# EAGLE design CANFLYSKY (EAGLE 9.0.1)
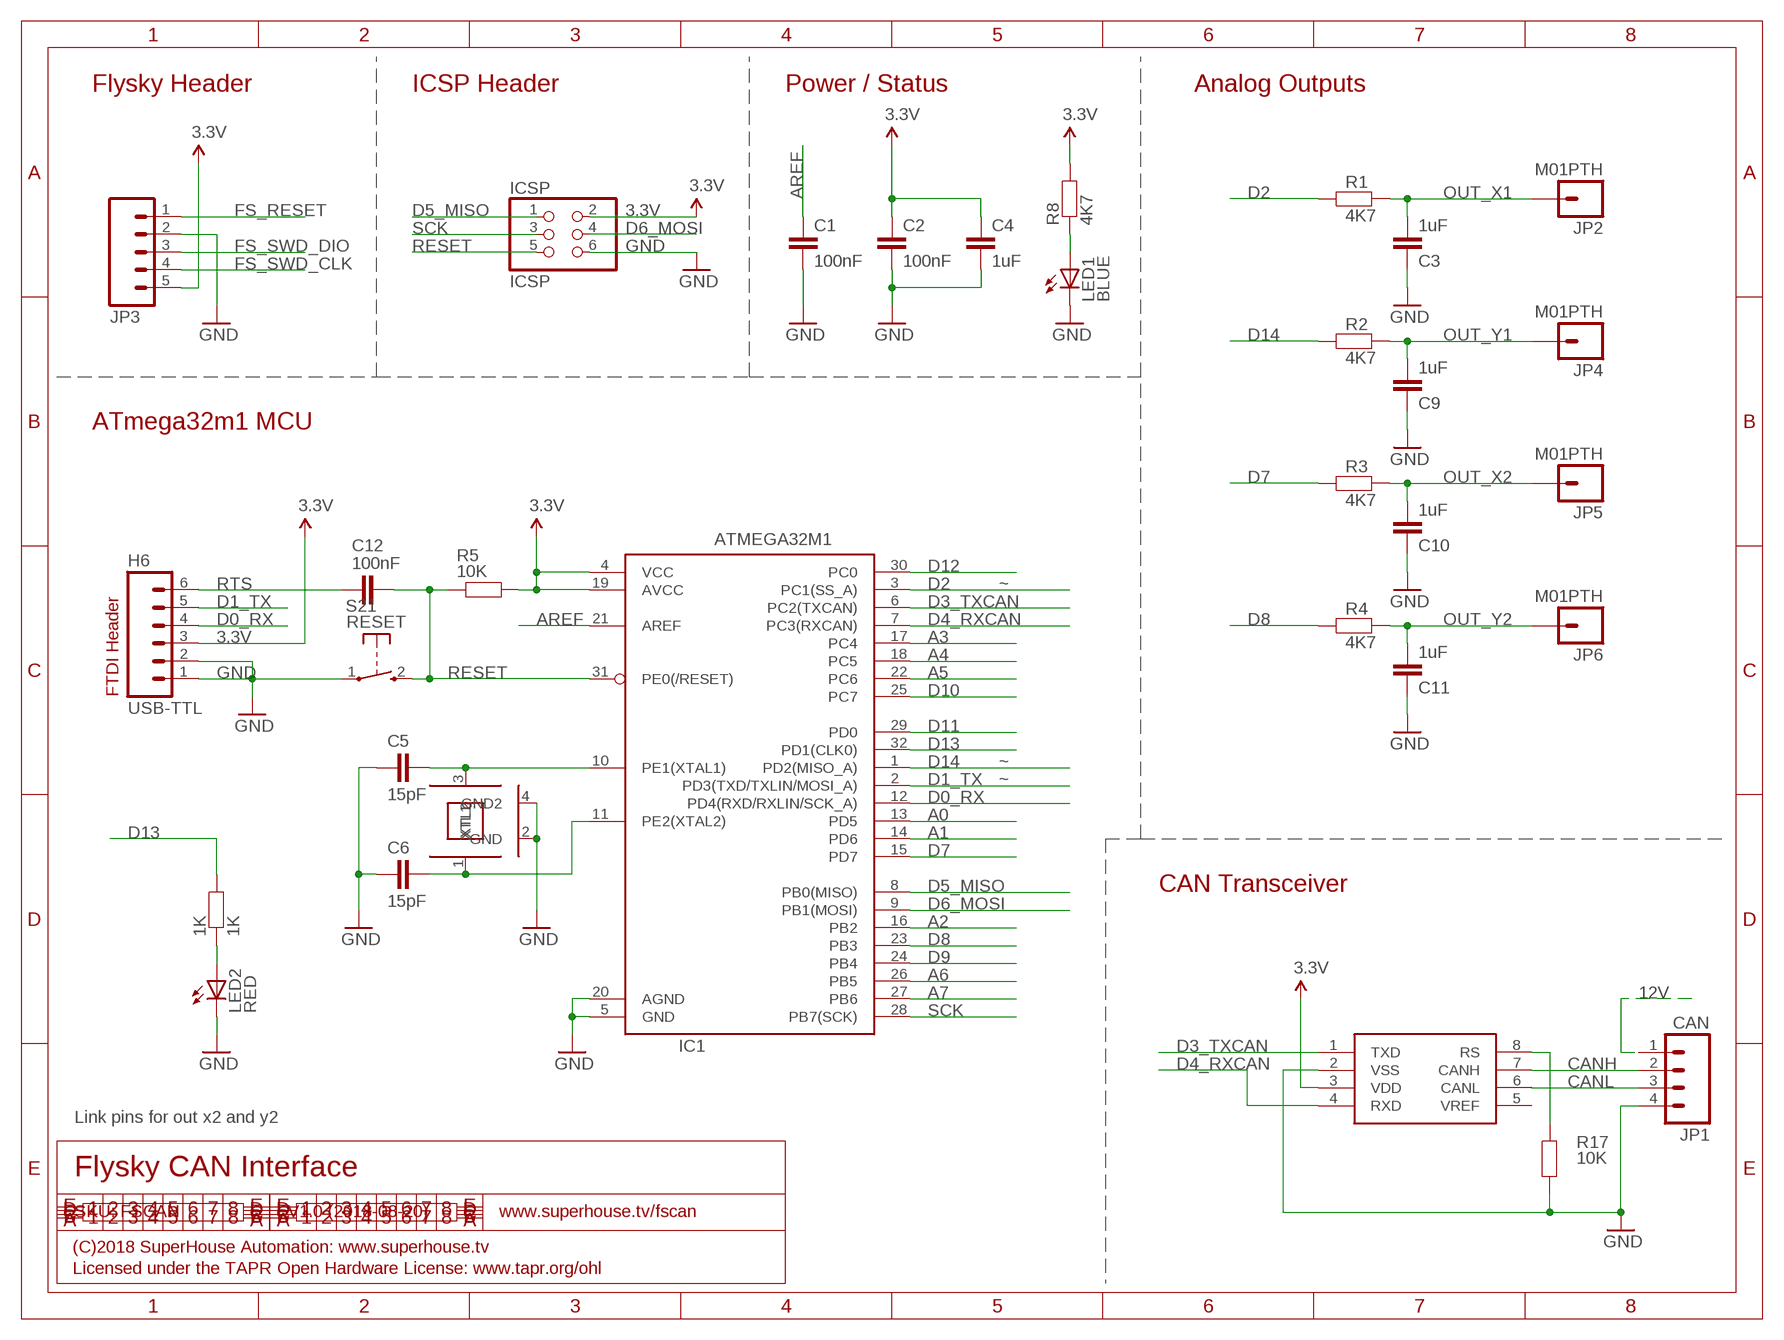
[diagram p0: schematic, sheet 1]

## Parts
1K  1K  RESISTOR0603  [0603]
C1  100nF  CAP0603  [0603]
C2  100nF  CAP0603  [0603]
C3  1uF  CAP0603  [0603]
C4  1uF  CAP0603  [0603]
C5  15pF  CAP0603  [0603]
C6  15pF  CAP0603  [0603]
C9  1uF  CAP0603  [0603]
C10  1uF  CAP0603  [0603]
C11  1uF  CAP0603  [0603]
C12  100nF  CAP0603  [0603]
H6  USB-TTL  M06SIP  [1X06]
IC1  ATMEGA32M1  [TQFP32-08]
ICSP  ICSP  PINHD-2X3  [2X03]
JP1  CAN  M04PTH  [1X04]
JP2  M01PTH  [1X01]
JP3  M05PTH  [1X05]
JP4  M01PTH  [1X01]
JP5  M01PTH  [1X01]
JP6  M01PTH  [1X01]
LED1  BLUE  LED0603  [LED-0603]
LED2  RED  LED0603  [LED-0603]
R1  4K7  RESISTOR0603  [0603]
R2  4K7  RESISTOR0603  [0603]
R3  4K7  RESISTOR0603  [0603]
R4  4K7  RESISTOR0603  [0603]
R5  10K  RESISTOR0603  [0603]
R8  4K7  RESISTOR0603  [0603]
R17  10K  RESISTOR0603  [0603]
S21  RESET  TAC_SWITCH_2PINSMT  [TACTILE_SWITCH_SMD_2PIN_TINY]
U1  MCP2551  [SO08]
XTL1  8MHz  CRYSTAL-GND3X2  [CRYSTAL-SMD-3X2]

## Nets
3.3V: C2.1 C4.1 H6.3 IC1.4(VCC) IC1.19(AVCC) ICSP.2 JP3.5 R5.1 R8.2 U1.3(VDD)
12V: JP1.1
A0: IC1.13(PD5)
A1: IC1.14(PD6)
A2: IC1.16(PB2)
A3: IC1.17(PC4)
A4: IC1.18(PC5)
A5: IC1.22(PC6)
A6: IC1.26(PB5)
A7: IC1.27(PB6)
AREF: C1.1 IC1.21(AREF)
CANH: JP1.2 U1.7(CANH)
CANL: JP1.3 U1.6(CANL)
D0_RX: H6.4 IC1.12(PD4(RXD/RXLIN/SCK_A))
D1_TX: H6.5 IC1.2(PD3(TXD/TXLIN/MOSI_A))
D2: IC1.3(PC1(SS_A)) R1.1
D3_TXCAN: IC1.6(PC2(TXCAN)) U1.1(TXD)
D4_RXCAN: IC1.7(PC3(RXCAN)) U1.4(RXD)
D5_MISO: IC1.8(PB0(MISO)) ICSP.1
D6_MOSI: IC1.9(PB1(MOSI)) ICSP.4
D7: IC1.15(PD7) R3.1
D8: IC1.23(PB3) R4.1
D9: IC1.24(PB4)
D10: IC1.25(PC7)
D11: IC1.29(PD0)
D12: IC1.30(PC0)
D13: 1K.2 IC1.32(PD1(CLK0))
D14: IC1.1(PD2(MISO_A)) R2.1
FS_RESET: JP3.1
FS_SWD_CLK: JP3.4
FS_SWD_DIO: JP3.3
GND: C1.2 C2.2 C3.2 C4.2 C5.1 C6.1 C9.2 C10.2 C11.2 H6.1 H6.2 IC1.5(GND) IC1.20(AGND) ICSP.6 JP1.4 JP3.2 LED1.C LED2.C R17.1 S21.1(P) U1.2(VSS) XTL1.2(GND) XTL1.4(GND2)
N$1: 1K.1 LED2.A
N$5: LED1.A R8.1
N$11: C5.2 IC1.10(PE1(XTAL1)) XTL1.3(XTL2)
N$12: C6.2 IC1.11(PE2(XTAL2)) XTL1.1(XTL1)
N$16: R17.2 U1.8(RS)
OUT_X1: C3.1 JP2.1 R1.2
OUT_X2: C10.1 JP5.1 R3.2
OUT_Y1: C9.1 JP4.1 R2.2
OUT_Y2: C11.1 JP6.1 R4.2
RESET: C12.2 IC1.31(PE0(/RESET)) ICSP.5 R5.2 S21.2(S)
RTS: C12.1 H6.6
SCK: IC1.28(PB7(SCK)) ICSP.3
Unconnected: U1.5(VREF)

## Notes on the sheet
- Flysky Header | ICSP Header | Power / Status | Analog Outputs
- ATmega32m1 MCU
- ~
- FTDI Header
- ~
- ~
- CAN Transceiver
- Link pins for out x2 and y2
- Flysky CAN Interface
- SKU: FSCAN | V1.0 (2018-08-20) | www.superhouse.tv/fscan
- (C)2018 SuperHouse Automation: www.superhouse.tv
- Licensed under the TAPR Open Hardware License: www.tapr.org/ohl

## Library data of the parts
1K R8 = freetronics-jon:RESISTOR: Resistor Basic schematic elements and footprints for 0603, 1206, and PTH 1/10th watt (small) resistors.
C1-C6 C9-C12 = freetronics-master-v1.1:CAP: Capacitor Standard 0603 ceramic capacitor, and 0.1" leaded capacitor.
H6 = freetronics:M06: Header 6 Standard 6-pin 0.1" header. Use with straight break away headers (SKU : PRT-00116), right angle break away headers (PRT-00553), swiss pins (PRT-00743), machine pins (PRT-00117), and female headers (PRT-00115). Molex polarized connector foot print use with SKU : PRT-08094 with associated crimp pins and housings. NOTES ON THE VARIANTS LOCK and LOCK_LONGPADS... This footprint was designed to help hold the alignment of a through-hole component (i.e. 6-pin header) while soldering it into place. You may notice that each hole has been shifted either up or down by 0.005 of an inch from it's more standard position (which is a perfectly straight line). This slight alteration caused the pins (the squares in the middle) to touch the edges of the holes. Because they are alternating, it causes a "brace" to hold the component in place. 0.005 has proven to be the perfect amount of "off-center" position when using our standard breakaway headers. Although looks a little odd when you look at the bare footprint, once you have a header in there, the alteration is very hard to notice. Also, if you push a header all the way into place, it is covered up entirely on the bottom side. This idea of altering the position of holes to aid alignment will be further integrated into the Sparkfun Library for other footprints. It can help hold any component with 3 or more connection pins.
IC1 = freetronics-jon:ATMEGA32M1
ICSP = pinhead:PINHD-2X3: PIN HEADER
JP1 = freetronics-jon:M04: Header 4 Standard 4-pin 0.1" header. Use with straight break away headers (SKU : PRT-00116), right angle break away headers (PRT-00553), swiss pins (PRT-00743), machine pins (PRT-00117), and female headers (PRT-00115). Molex polarized connector foot print use with SKU : PRT-08231 with associated crimp pins and housings. 1MM SMD Version SKU: PRT-10208
JP2 JP4-JP6 = freetronics-jon:M01: Header 1 Standard 1-pin 0.1" header. Use with straight break away headers (SKU : PRT-00116), right angle break away headers (PRT-00553), swiss pins (PRT-00743), machine pins (PRT-00117), and female headers (PRT-00115).
JP3 = freetronics-jon:M05: Header 5 Standard 5-pin 0.1" header. Use with straight break away headers (SKU : PRT-00116), right angle break away headers (PRT-00553), swiss pins (PRT-00743), machine pins (PRT-00117), and female headers (PRT-00115). Molex polarized connector foot print use with SKU : PRT-08230 with associated crimp pins and housings.
LED1 LED2 = freetronics-jon:LED: LEDs Standard schematic elements and footprints for 5mm, 3mm, 1206, and 0603 sized LEDs. 5mm - Spark Fun Electronics SKU : COM-00529 (and others)
R1-R5 R17 = freetronics-master-v1.1:RESISTOR: Resistor Basic schematic elements and footprints for 0603, 1206, and PTH 1/10th watt (small) resistors.
S21 = freetronics-jon:TAC_SWITCH_2PIN: Momentary Tactile Switch - 2 pin
U1 = freetronics-original:MCP2551
XTL1 = freetronics-jon:CRYSTAL-GND

## Board
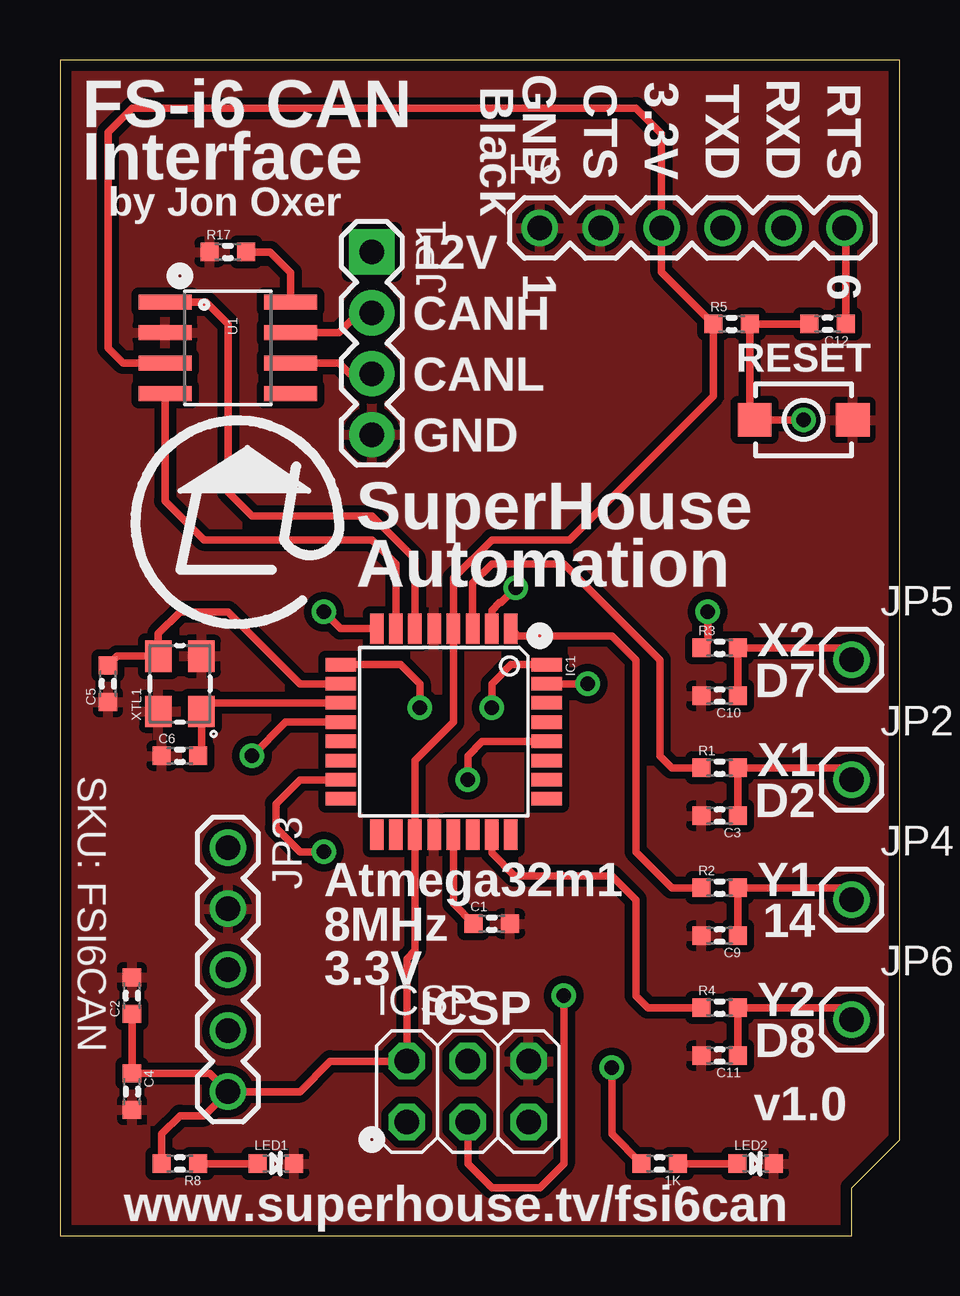
[diagram p1: board, top side]
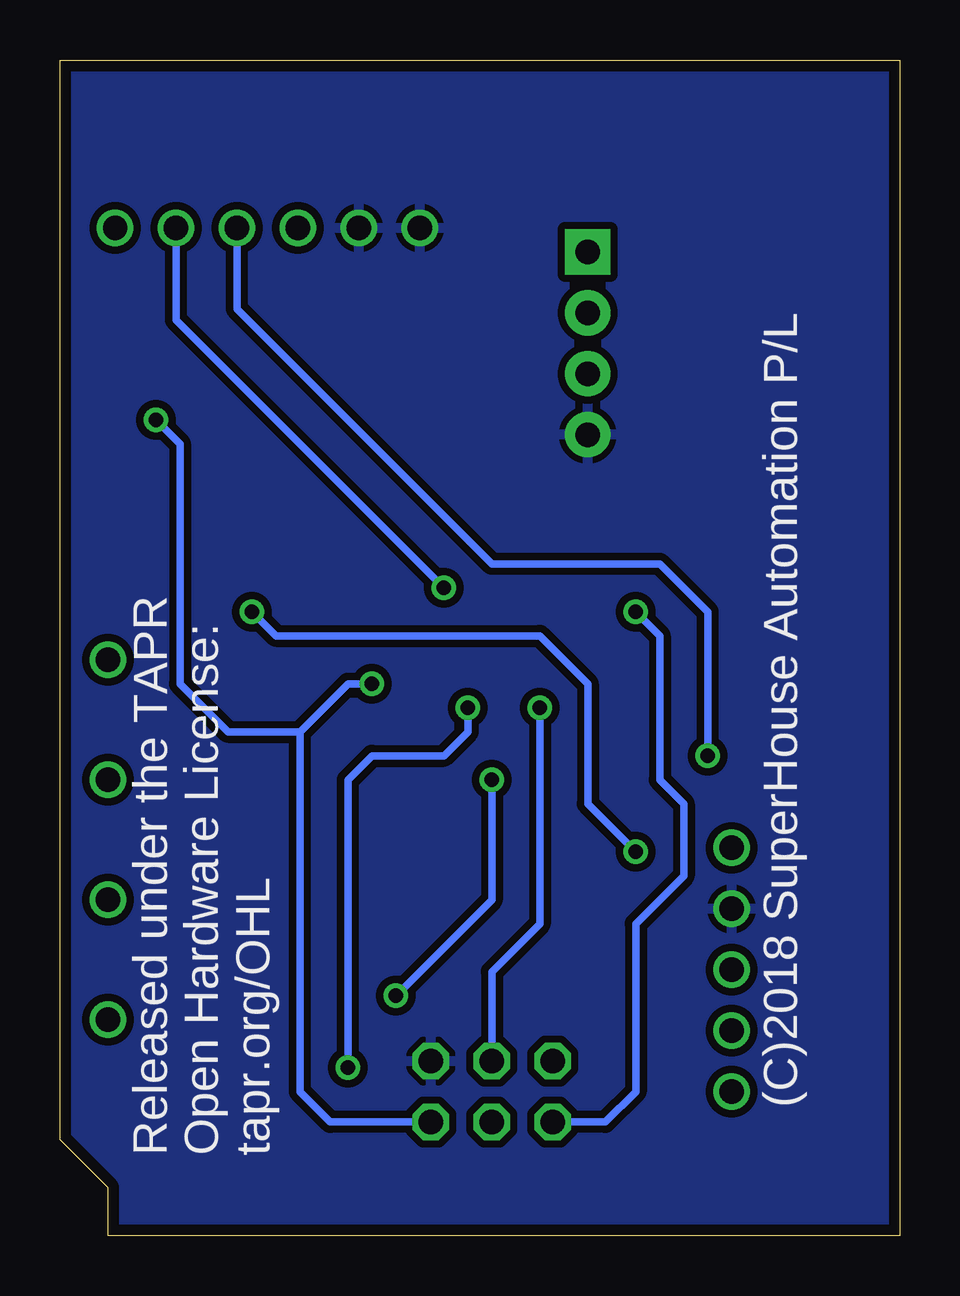
[diagram p2: board, bottom side, seen from below]

Size 35 x 49 mm. Coordinates in mm from the lower left corner, seen from the top.
Outline: 35,4 35,49 0,49 0,0 33,0 33,2 35,4
Copper layers (1*16): Top 0.035mm / dielectric 1.5mm / Bottom 0.035mm
Design rules "default *": minimum track width 10mil, minimum drill 24mil, track to track 12mil, track to pad 12mil, pad to pad 12mil, via to via 12mil, smd to smd 8mil, copper to edge 18mil, drill to drill 8mil, minimum pad ring 10mil, minimum via ring 8mil, stop-mask expansion 4mil, vias tented up to drill 0mil, thermal gap 10mil

### Footprints (pad centres in the part's own frame; a part is rotated, then mirrored left to right if it is on the bottom)
0603 = smd 0.762 x 0.762: 1 -0.762,0; 2 0.762,0
1X06 = drill 1.016: 1 0,0; 2 2.54,0; 3 5.08,0; 4 7.62,0; 5 10.16,0; 6 12.7,0
TQFP32-08 = smd 1.27 x 0.559: 1 -4.293,2.8; 2 -4.293,2; 3 -4.293,1.2; 4 -4.293,0.4; 5 -4.293,-0.4; 6 -4.293,-1.2; 7 -4.293,-2; 8 -4.293,-2.8; 17 4.293,-2.8; 18 4.293,-2; 19 4.293,-1.2; 20 4.293,-0.4; 21 4.293,0.4; 22 4.293,1.2; 23 4.293,2; 24 4.293,2.8 | smd 0.559 x 1.27: 9 -2.8,-4.293; 10 -2,-4.293; 11 -1.2,-4.293; 12 -0.4,-4.293; 13 0.4,-4.293; 14 1.2,-4.293; 15 2,-4.293; 16 2.8,-4.293; 25 2.8,4.293; 26 2,4.293; 27 1.2,4.293; 28 0.4,4.293; 29 -0.4,4.293; 30 -1.2,4.293; 31 -2,4.293; 32 -2.8,4.293
2X03 = drill 1.016 octagon: 1 -2.54,-1.27; 2 -2.54,1.27; 3 0,-1.27; 4 0,1.27; 5 2.54,-1.27; 6 2.54,1.27
1X04 = drill 1.016 pad 1.88 square: 1 0,0 | drill 1.016 pad 1.88: 2 2.54,0; 3 5.08,0; 4 7.62,0
1X01 = drill 1.016: 1 0,0
1X05 = drill 1.016: 1 0,0; 2 2.54,0; 3 5.08,0; 4 7.62,0; 5 10.16,0
LED-0603 = smd 0.762 x 0.762: A -0.762,0; C 0.762,0
TACTILE_SWITCH_SMD_2PIN_TINY = smd 1.4 x 1.4: 1 -2.05,0; 2 2.05,0
SO08 = smd 0.61 x 2.21: 1 -1.905,-2.616; 2 -0.635,-2.616; 3 0.635,-2.616; 4 1.905,-2.616; 5 1.905,2.616; 6 0.635,2.616; 7 -0.635,2.616; 8 -1.905,2.616
CRYSTAL-SMD-3X2 = smd 1.3 x 1.1: 1 -1.15,-0.9; 2 1.15,-0.9; 3 1.15,0.9; 4 -1.15,0.9

### Placement (x,y rotation side)
1K  25,3 180 top
C1  18,13 0 top
C2  3,10 90 top
C3  27.5,17.5 180 top
C4  3,6 270 top
C5  2,23 90 top
C6  5,20 0 top
C9  27.5,12.5 180 top
C10  27.5,22.5 180 top
C11  27.5,7.5 180 top
C12  32,38 180 top
H6  20,42 0 top
IC1  16,21 270 top
ICSP  17,6 0 top
JP1  13,41 270 top
JP2  33,19 0 top
JP3  7,16.16 270 top
JP4  33,14 0 top
JP5  33,24 0 top
JP6  33,9 0 top
LED1  9,3 0 top
LED2  29,3 0 top
R1  27.5,19.5 0 top
R2  27.5,14.5 0 top
R3  27.5,24.5 0 top
R4  27.5,9.5 0 top
R5  28,38 0 top
R8  5,3 180 top
R17  7,41 0 top
S21  31,34 180 top
U1  7,37 270 top
XTL1  5,23 90 top

### Tracks (layer width: path | path; a pad name or v marks a point on that pad's centre or on a via)
3.3V
  Top 0.305: C2.1 C4.1 6.24,6.76 JP3.5 | JP3.5 10,6 11.27,7.27 ICSP.2 14.46,11.54 14.8,11.88 IC1.19 14.8,19.8 16.4,21.4 IC1.4 16.4,27.4 18,29 21.24,29 27.24,35 R5.1 25.08,40.16 H6.3 25.08,45.92 24,47 3,47 2,46 2,37 2.63,36.37 U1.3 | R8.2 4.24,4.24 5,5 6,5 JP3.5
AREF
  Top 0.305: C1.1 16.4,13.84 IC1.21
CANH
  Top 0.305: U1.7 11.63,37.63 12.46,38.46 JP1.2
CANL
  Top 0.305: U1.6 11.63,36.37 12.08,35.92 JP1.3
D0_RX  (via drill 0.61)
  Top 0.305: IC1.12 9.4,21.4 v8,20
  Bottom 0.305: v8,20 8,26 10,28 17,28 27.62,38.62 H6.4
D1_TX  (via drill 0.61)
  Top 0.305: v19,27 18.39,26.39 18.33,26.39 18,26.05 IC1.2
  Bottom 0.305: v19,27 30.16,38.16 H6.5
D2
  Top 0.305: R1.1 25.5,19.5 25,20 25,24 21,28 18,28 17.2,27.2 IC1.3
D3_TXCAN
  Top 0.305: U1.1 6.09,38.91 7,38 7,31 8,30 13,30 14.8,28.2 IC1.6
D4_RXCAN
  Top 0.305: U1.4 4.38,30.62 6,29 13,29 14,28 IC1.7
D5_MISO  (via drill 0.61)
  Top 0.305: IC1.8 11.71,25.29 v11,26
  Bottom 0.305: v11,26 10,25 10,19 9,18 9,15 11,13 11,6 12.27,4.73 ICSP.1
D6_MOSI  (via drill 0.61)
  Top 0.305: IC1.9 14.2,23.8 15,23 v15,22
  Bottom 0.305: v15,22 15,13 17,11 ICSP.4
D7  (via drill 0.61)
  Top 0.305: R3.1 27,24.76 v27,26 | IC1.15 10,19 9,18 9,17 10,16 v11,16
  Bottom 0.305: v27,26 26,25 15,25 13,23 13,18 v11,16
D8
  Top 0.305: R4.1 24.5,9.5 24,10 24,14 23,15 18.95,15 18,15.95 IC1.23
D13  (via drill 0.61)
  Top 0.305: 1K.2 23,4.24 v23,7 | v18,22 18,23 18.8,23.8 IC1.32
  Bottom 0.305: v18,22 18,21 19,20 22,20 23,19 v23,7
D14
  Top 0.305: R2.1 25.5,14.5 24,16 24,24 23,25 19.09,25 IC1.1
GND
  pour Bottom: 35,4 33,2 33,0 0,0 0,49 35,49
  pour Top: 35,4 33,2 33,0 0,0 0,49 35,49
N$1
  Top 0.305: LED2.A 1K.1
N$5
  Top 0.305: R8.1 LED1.A
N$11
  Top 0.305: C5.2 2.39,24.15 XTL1.3 4.1,25.1 5,26 7,26 10,23 IC1.10
N$12
  Top 0.305: C6.2 5.9,20.14 XTL1.1 6.25,22.2 IC1.11
N$16
  Top 0.305: R17.2 8.76,41 9.62,40.15 U1.8
OUT_X1
  Top 0.305: C3.1 R1.2 32.5,19.5 JP2.1
OUT_X2
  Top 0.305: C10.1 R3.2 32.5,24.5 JP5.1
OUT_Y1
  Top 0.305: C9.1 R2.2 32.5,14.5 JP4.1
OUT_Y2
  Top 0.305: C11.1 R4.2 32.5,9.5 JP6.1
RESET  (via drill 0.61)
  Top 0.305: C12.2 R5.2 28.76,34.19 S21.2 v31,34 | v22,23 IC1.31
  Bottom 0.305: ICSP.5 23.73,4.73 25,6 25,21 | 25,21 23,23 v22,23 | v31,34 30,33 30,23 28,21 25,21
RTS
  Top 0.305: H6.6 32.76,41.94 C12.1
SCK  (via drill 0.61)
  Top 0.305: IC1.28 17.6,20.6 17,20 v17,19 | v21,10 21,3 20,2 18,2 17,3 ICSP.3
  Bottom 0.305: v17,19 17,14 v21,10

### Text on the board
tPlace: FS-i6 CAN / Interface | GND | CTS | 3.3V | TXD | RXD | RTS | by Jon Oxer | Black | 12V | 1 | 6 | CANH | CANL | RESET | GND | SuperHouse / Automation | X2 / D7 | SKU: FSI6CAN | X1 / D2 | Y1 / 14 | Atmega32m1 / 8MHz / 3.3V | ICSP | Y2 / D8 | v1.0 | www.superhouse.tv/fsi6can
bPlace: (C)2018 SuperHouse Automation P/L | Released under the TAPR / Open Hardware License: / tapr.org/OHL